# Altium project Distance-Sensor-Board.PrjPcb
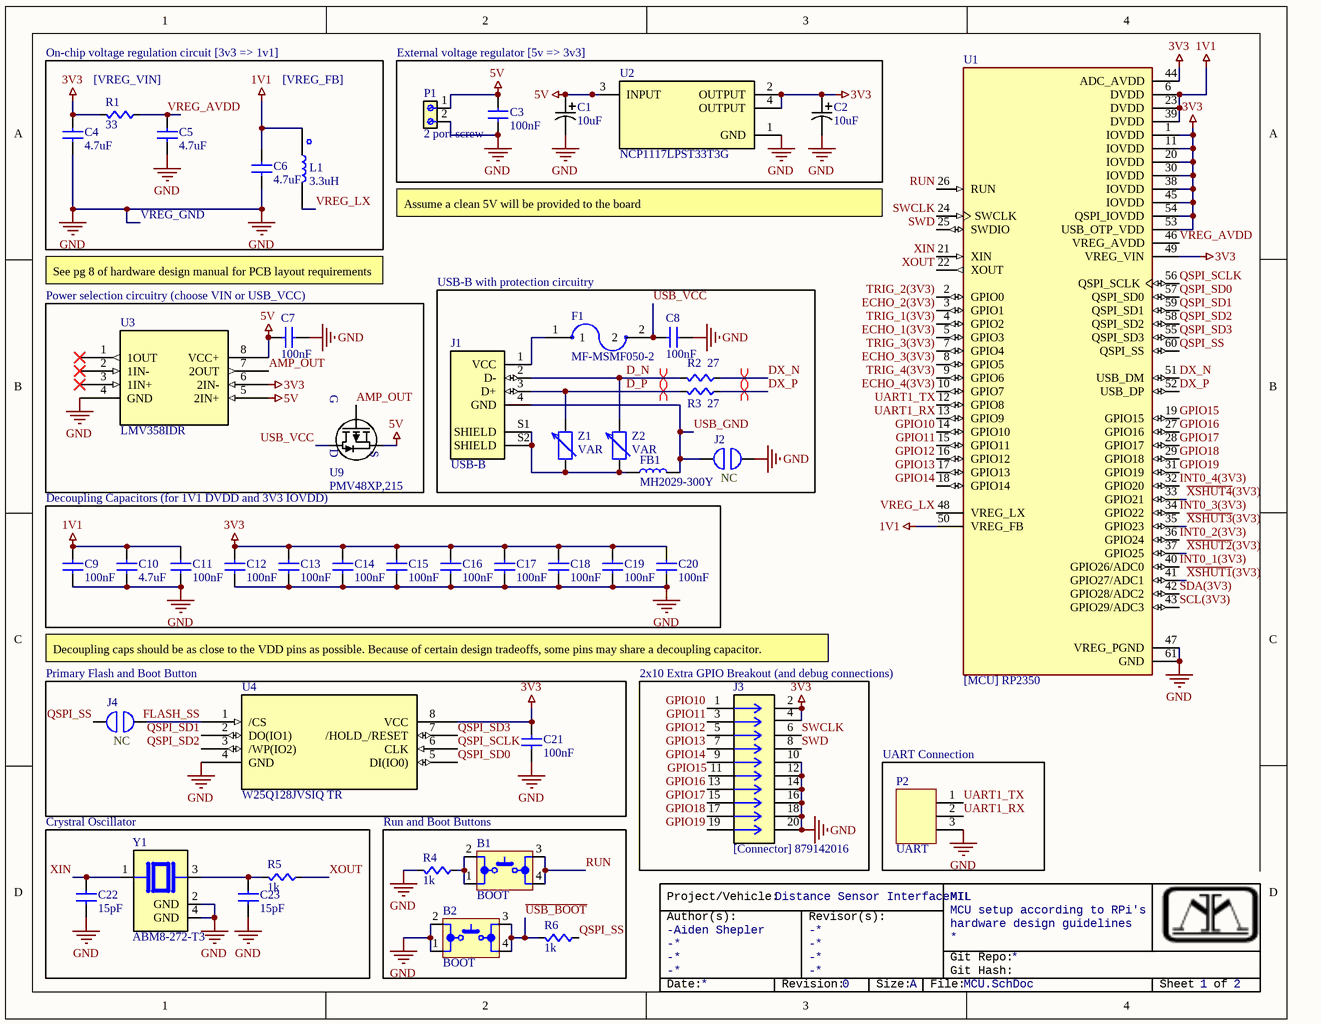
[diagram p0: MCU.SchDoc]
2 sheets, 85 parts. Net scope: global (net labels, ports and power ports of the same name join across sheets).
Board file: main.PcbDoc
Sheets:
  MCU.SchDoc
  Distance-Sensors.SchDoc

## Sheet MCU.SchDoc
size A; Organization: MIL; Address1: MCU setup according to RPi's; Address2: hardware design guidelines; Revision: 0; SheetNumber: 1; SheetTotal: 2; Project: Distance Sensor Interface; Author1: Aiden Shepler

### Parts
B1  BOOT  [SPST-PUSH-BUTTON]
B2  BOOT  [SPST-PUSH-BUTTON]
C1  10uF  [RADIAL_CAN_CAP_4_X_5.8_SMD]
C2  10uF  [RADIAL_CAN_CAP_4_X_5.8_SMD]
C3  value 100nF  [CAPC0603]  (hidden comment: Cap)
C4  value 4.7uF  [CAPC0603]  (hidden comment: Cap)
C5  value 4.7uF  [CAPC0603]  (hidden comment: Cap)
C6  value 4.7uF  [CAPC0603]  (hidden comment: Cap)
C7  value 100nF  [CAPC0603]  (hidden comment: Cap)
C8  value 100nF  [CAPC0603]  (hidden comment: Cap)
C9  value 100nF  [CAPC0603]  (hidden comment: Cap)
C10  value 4.7uF  [CAPC0603]  (hidden comment: Cap)
C11  value 100nF  [CAPC0603]  (hidden comment: Cap)
C12  value 100nF  [CAPC0603]  (hidden comment: Cap)
C13  value 100nF  [CAPC0603]  (hidden comment: Cap)
C14  value 100nF  [CAPC0603]  (hidden comment: Cap)
C15  value 100nF  [CAPC0603]  (hidden comment: Cap)
C16  value 100nF  [CAPC0603]  (hidden comment: Cap)
C17  value 100nF  [CAPC0603]  (hidden comment: Cap)
C18  value 100nF  [CAPC0603]  (hidden comment: Cap)
C19  value 100nF  [CAPC0603]  (hidden comment: Cap)
C20  value 100nF  [CAPC0603]  (hidden comment: Cap)
C21  value 100nF  [CAPC0603]  (hidden comment: Cap)
C22  value 15pF  [CAPC0603]  (hidden comment: Cap)
C23  value 15pF  [CAPC0603]  (hidden comment: Cap)
F1  MF-MSMF050-2  [FUSM4632X85]
FB1  MH2029-300Y  [L0805]
J1  USB-B  [SAMTEC_USB-B-S-X-X-TH]
J2  NO/NC: NC  [[Jumper] Solderable Jumper]  (hidden comment: Thru-Hole Jumper)
J3  [Connector] 879142016  [[Connector] CONN20]
J4  NO/NC: NC  [[Jumper] Solderable Jumper]  (hidden comment: Thru-Hole Jumper)
L1  3.3uH  [2016_SMD_Inductor]
P1  2 port screw  [[CONNECTOR] 5MM_2PORT_SCREW]
P2  UART  [MOLEX-HDR-1X3-SHERLOCK-RA]
R1  value 33  [RES0603]  (hidden comment: Res)
R2  value 27  [RES0603]  (hidden comment: Res)
R3  value 27  [RES0603]  (hidden comment: Res)
R4  value 1k  [RES0603]  (hidden comment: Res)
R5  value 1k  [RES0603]  (hidden comment: Res)
R6  value 1k  [RES0603]  (hidden comment: Res)
U1  [MCU] RP2350  [QFN40P700X700X90-61N]
U2  NCP1117LPST33T3G  [SOT230P700X175-4N]
U3  LMV358IDR  [SOIC-8]
U4  W25Q128JVSIQ TR  [SOIC_208MIL_WIN]
U9  PMV48XP,215  [SOT23_NEX]
Y1  ABM8-272-T3  [XTAL_ABM8-272-T3]
Z1  VAR  [VARC1608X56N]
Z2  VAR  [VARC1608X56N]

### Blocks framed on the sheet
External voltage regulator [5v => 3v3]: C1-C3 P1 U2
USB-B with protection circuitry: C8 F1 FB1 J1 J2 R2 R3 Z1 Z2
Power selection circuitry (choose VIN or USB_VCC): C7 U3 U9
Decoupling Capacitors (for 1V1 DVDD and 3V3 IOVDD): C9-C20
Primary Flash and Boot Button: C21 J4 U4
2x10 Extra GPIO Breakout (and debug connections): J3
UART Connection: P2
Crystral Oscillator: C22 C23 R5 Y1
Run and Boot Buttons: B1 B2 R4 R6

### Nets
1V1: C6.1(A) C9.1(A) C10.1(A) C11.1(A) L1.1 U1.6(DVDD) U1.23(DVDD) U1.39(DVDD) U1.50(VREG_FB)
3V3: C2.1 C4.1(A) C12.1(A) C13.1(A) C14.1(A) C15.1(A) C16.1(A) C17.1(A) C18.1(A) C19.1(A) C20.1(A) C21.1(A) J3.2 J3.4 R1.1(A) U1.1(IOVDD) U1.11(IOVDD) U1.20(IOVDD) U1.30(IOVDD) U1.38(IOVDD) U1.44(ADC_AVDD) U1.45(IOVDD) U1.49(VREG_VIN) U1.53(USB_OTP_VDD) U1.54(QSPI_IOVDD) U2.2(OUTPUT) U2.4(OUTPUT) U3.6(2IN-) U4.8(VCC)
5V: C1.1 C3.1(A) C7.1(A) P1.1 U2.3(INPUT) U3.5(2IN+) U3.8(VCC+) U9.2(S)
GND: B2.1 B2.2 C1.2 C2.2 C3.2(B) C4.2(B) C5.2(B) C6.2(B) C7.2(B) C8.1(A) C9.2(B) C10.2(B) C11.2(B) C12.2(B) C13.2(B) C14.2(B) C15.2(B) C16.2(B) C17.2(B) C18.2(B) C19.2(B) C20.2(B) C21.2(B) C22.2(B) C23.2(B) J2.2 J3.10 J3.12 J3.14 J3.16 J3.18 J3.20 P1.2 P2.3 R4.1(A) U1.47(VREG_PGND) U1.61(GND) U2.1(GND) U3.4(GND) U4.4(GND) Y1.2(GND) Y1.4(GND)
AMP_OUT: U3.7(2OUT) U9.1(G)
D_N: J1.2(D-) R2.1(A) Z2.2
D_P: J1.3(D+) R3.1(A) Z1.2
DX_N: R2.2(B) U1.51(USB_DM)
DX_P: R3.2(B) U1.52(USB_DP)
ECHO_1(3V3): U1.5(GPIO3)
ECHO_2(3V3): U1.3(GPIO1)
ECHO_3(3V3): U1.8(GPIO5)
ECHO_4(3V3): U1.10(GPIO7)
FLASH_SS: J4.2 U4.1(/CS)
GPIO10: J3.1 U1.14(GPIO10)
GPIO11: J3.3 U1.15(GPIO11)
GPIO12: J3.5 U1.16(GPIO12)
GPIO13: J3.7 U1.17(GPIO13)
GPIO14: J3.9 U1.18(GPIO14)
GPIO15: J3.11 U1.19(GPIO15)
GPIO16: J3.13 U1.27(GPIO16)
GPIO17: J3.15 U1.28(GPIO17)
GPIO18: J3.17 U1.29(GPIO18)
GPIO19: J3.19 U1.31(GPIO19)
INT0_1(3V3): U1.40(GPIO26/ADC0)
INT0_2(3V3): U1.36(GPIO24)
INT0_3(3V3): U1.34(GPIO22)
INT0_4(3V3): U1.32(GPIO20)
QSPI_SCLK: U1.56(QSPI_SCLK) U4.6(CLK)
QSPI_SD0: U1.57(QSPI_SD0) U4.5(DI(IO0))
QSPI_SD1: U1.59(QSPI_SD1) U4.2(DO(IO1))
QSPI_SD2: U1.58(QSPI_SD2) U4.3(/WP(IO2))
QSPI_SD3: U1.55(QSPI_SD3) U4.7(/HOLD_/RESET)
QSPI_SS: J4.1 R6.2(B) U1.60(QSPI_SS)
RUN: B1.3 B1.4 U1.26(RUN)
SCL(3V3): U1.43(GPIO29/ADC3)
SDA(3V3): U1.42(GPIO28/ADC2)
SWCLK: J3.6 U1.24(SWCLK)
SWD: J3.8 U1.25(SWDIO)
TRIG_1(3V3): U1.4(GPIO2)
TRIG_2(3V3): U1.2(GPIO0)
TRIG_3(3V3): U1.7(GPIO4)
TRIG_4(3V3): U1.9(GPIO6)
~{USB_BOOT}: B2.3 B2.4 R6.1(A)
UART1_RX: P2.2 U1.13(GPIO9)
UART1_TX: P2.1 U1.12(GPIO8)
USB_GND: FB1.2 J1.4(GND) J2.1
USB_VCC: C8.2(B) F1.2 U9.3(D)
VREG_AVDD: C5.1(A) R1.2(B) U1.46(VREG_AVDD)
VREG_LX: L1.2 U1.48(VREG_LX)
~{XSHUT1}(3V3): U1.41(GPIO27/ADC1)
~{XSHUT2}(3V3): U1.37(GPIO25)
~{XSHUT3}(3V3): U1.35(GPIO23)
~{XSHUT4}(3V3): U1.33(GPIO21)
XIN: C22.1(A) U1.21(XIN) Y1.1
XOUT: R5.2(B) U1.22(XOUT)
NetB1_1: B1.1 B1.2 R4.2(B)
NetC23_1: C23.1(A) R5.1(A) Y1.3
NetF1_1: F1.1 J1.1(VCC)
NetFB1_1: FB1.1 J1.S1(SHIELD) J1.S2(SHIELD) Z1.1 Z2.1

Not connected (* = marked no-connect by the designer): U3 1(1OUT)* 2(1IN-)* 3(1IN+)*

### Layout directives
differential pair: D_N, D_P, DX_N, DX_P

### Notes on the sheet
- On-chip voltage regulation circuit [3v3 => 1v1]
- [VREG_VIN]
- [VREG_FB]
- VREG_GND
- Assume a clean 5V will be provided to the board
- See pg 8 of hardware design manual for PCB layout requirements
- Decoupling caps should be as close to the VDD pins as possible. Because of certain design tradeoffs, some pins may share a decoupling capacitor.
- Project/Vehicle:
- Author(s):
- -
- Revisor(s):
- Git Repo:
- Git Hash:
- Date:
- Revision:
- Size:
- A
- File:
- Sheet
- of

### Library data of the parts
B1 B2 = 1825910-6: SWITCH TACTILE SPST-NO 0.05A 24V; Manufacturer: TE Connectivity Alcoswitch; Actuator Material: PBT; Mechanical Life: 100000Cycles; Operating Force: 160gf; Throw Configuration: SPST; Illumination Type: Non-Illuminated,Illuminated; Switch Travel: 0.25mm; Switch Function: Off-Mom; Contact Current Rating: 50mA; Actuator Type: Standard; Contact Resistance: 100mR; Actuator Length: 0.055inch; Manufacturer Part Number: 1825910-6; RoHS: Yes; Category: Pushbutton Switches; Stock 1: 97530; Pricing 1: 1=0,10000, 10=0,10100, 25=0,09560, 100=0,08700, 250=0,08180, 500=0,07484, 1000=0,06265, 2500=0,06092, 5000=0,05743 (USD); Mount: Through Hole; Contact Material: Copper Alloy; Contact Plating: Silver; Min Operating Temperature: -35°C; Max Operating Temperature: 85°C; Termination: PC Pins; Package Quantity: 750; Packaging: Loose Piece; Orientation: Straight; Max Voltage Rating (DC): 24V; Electrical Life: 100000Cycles; Max Current Rating: 50mA; Type: Switch; Length: 5.99mm; REACH SVHC: Unknown; ELV: Compliant; Lead Free: Lead Free; ComponentLink1URL: https://datasheet.ciiva.com/30199/1825910-6rqpn1825910-6-30199520.pdf?src-supplier=Onlinecomponents.com; ComponentLink1Description: https://datasheet.ciiva.com/30199/1825910-6rqpn1825910-6-30199520.pdf?src-supplier=Onlinecomponents.com; ComponentLink2URL: https://datasheet.ciiva.com/15184/getdatasheetpartid-395915-15184509.pdf?src-supplier=Verical; ComponentLink2Description: https://datasheet.ciiva.com/15184/getdatasheetpartid-395915-15184509.pdf?src-supplier=Verical; Supplier 1: Digi-Key; Supplier Part Number 1: 450-1650-ND
C1 C2 = EEE-FK1E100R: 10uF electrolytic cap, radial can, SMD; Manufacturer_Name: Panasonic; Copyright: Copyright (C) 2025 Ultra Librarian. All rights reserved.; Manufacturer_Part_Number: EEE-FK1E100R
F1 = MF-MSMF050-2: [Fuse] Polymeric PTC Resettable Fuse 15V 500 mA Ih Surface Mount 1812 (4532 Metric), Concave; MF: Bourns; MP: MF-MSMF050-2; Availability: In Stock; Check_prices: https://www.snapeda.com/parts/MF-MSMF050-2/Bourns+-+J.W.+Miller/view-part/?ref=eda; Price: None; Package: 1812 Bourns; Purchase-URL: https://pricing.snapeda.com/search/part/MF-MSMF050-2/?ref=eda; Value: *; SnapEDA_Link: https://www.snapeda.com/parts/MF-MSMF050-2/Bourns+-+J.W.+Miller/view-part/?ref=snap
FB1 = MH2029-300Y: [Inductor] Ferrite Bead Bourns MH2029-300Y / SMD-FERRITE-BEAD-30R-3A(0805); SnapEDA_Link: https://www.snapeda.com/parts/MH2029-300Y/Bourns/view-part/?ref=snap; Package: 0805 Bourns; Value: *; MF: Bourns; MP: MH2029-300Y; Check_prices: https://www.snapeda.com/parts/MH2029-300Y/Bourns/view-part/?ref=eda
J1 = USB-B-S-X-X-TH: USB-B (USB TYPE-B) USB 2.0 Receptacle Connector 4 Position Through Hole, Right Angle; MF: Samtec; MP: USB-B-S-F-W-TH-TR; SnapEDA_Link: https://www.snapeda.com/parts/USB-B-S-F-W-TH-TR/Samtec/view-part/?ref=snap; Package: None; Value: *; Check_prices: https://www.snapeda.com/parts/USB-B-S-F-W-TH-TR/Samtec/view-part/?ref=eda
J2 J4 = [Jump] Thru-Hole 2pin: Clip Jumper
J3 = [Connector] 879142016: 2x10 2.54mm pitch header; Package: None; Price: None; Value: *; MP: 879142016; Availability: Unavailable
L1 = INDUCTOR 3.3uH: Power Inductors - SMD IND 3.3uH used for RP2350 VREG; Manufacturer_Name: ABRACON; Manufacturer_Part_Number: AOTA-B201610S3R3-101-T; Geometry.Height: 1mm; Mouser Part Number: 815-AB201610S3R3101T; Mouser Price/Stock: https://www.mouser.co.uk/ProductDetail/ABRACON/AOTA-B201610S3R3-101-T?qs=%252BXxaIXUDbq0IZvJW%2F2mv4w%3D%3D; Datasheet Link: https://abracon.com/datasheets/AOTA-B201610S3R3-101-T.pdf
P1 = [Connector] 691213510002: 2 Position Wire to Board Terminal Block Horizontal with Board 0.200 (5.08mm) Through Hole; MF: WÃ¼rth Elektronik; SnapEDA_Link: https://www.snapeda.com/parts/691213510002/W%25C3%25BCrth+Elektronik+Midcom/view-part/?ref=snap; Package: None; Value: *; MP: 691213510002; Check_prices: https://www.snapeda.com/parts/691213510002/W%25C3%25BCrth+Elektronik+Midcom/view-part/?ref=eda
P2 = MOLEX-HDR-1x3-SHERLOCK_RA: Header, Molex, 2mm Pitch Sherlock Header, Single Row, Right Angle 3 Circuits, Length 3.3mm; Manufacturer Part Number: 35363-0360; Manufacturer: Molex Connector Corporation; Supplier Part Number 1: WM18932-ND; Supplier 1: Digi-Key
R1-R6 = Res: SMD, RES0603; Supplier 1: Digi-Key; Supplier Part Number 1: RMCF0603JT10K0CT-ND
U1 = SC1509(13): RP2350A MCU from Raspberry Pi Pico; QFN 60 7x7,; MP: SC1509-A4; SnapEDA_Link: https://www.snapeda.com/parts/SC1509-A4/Raspberry+Pi/view-part/?ref=snap; Package: None; Value: *; MF: Raspberry Pi; Check_prices: https://www.snapeda.com/parts/SC1509-A4/Raspberry+Pi/view-part/?ref=eda
U2 = NCP1117LPST33T3G: Linear Voltage Regulator IC Positive Fixed 1 Output 1A SOT-223; MF: ON Semiconductor; SnapEDA_Link: https://www.snapeda.com/parts/NCP1117LPST33T3G/Onsemi/view-part/?ref=snap; Package: SOT-223-4 ON Semiconductor; Value: *; MP: NCP1117LPST33T3G; Check_prices: https://www.snapeda.com/parts/NCP1117LPST33T3G/Onsemi/view-part/?ref=eda
U3 = LMV358IDR: [Op-Amp] Dual, 5.5-V, 1-MHz, RRO operational amplifier 8-SOIC -40 to 125; Manufacturer_Name: Texas Instruments; Copyright: Copyright (C) 2025 Ultra Librarian. All rights reserved.; Manufacturer_Part_Number: LMV358IDR; Datasheet: https://www.ti.com/lit/gpn/lmv358; RefDes: RefDes; Type: Type
U4 = W25Q128JVSIQ TR: IC FLASH 128MBIT SPI/QUAD 8SOIC; Manufacturer_Name: Winbond; Copyright: Copyright (C) 2025 Ultra Librarian. All rights reserved.; Manufacturer_Part_Number: W25Q128JVSIQ TR; RefDes: RefDes; Type: Type
U9 = [PMOS] PMV48XP,215: MOSFET P-CH 20V 3.5A TO236AB; Manufacturer_Name: Nexperia; Copyright: Copyright (C) 2025 Ultra Librarian. All rights reserved.; Manufacturer_Part_Number: PMV48XP,215
Y1 = ABM8-272-T3: 12 MHz Â±30ppm Crystal 10pF 50 Ohms 4-SMD, No Lead; MF: ABRACON; SnapEDA_Link: https://www.snapeda.com/parts/ABM8-272-T3/Abracon/view-part/?ref=snap; Package: NON-STANDARD-4 Abracon; Value: *; MP: ABM8-272-T3; Check_prices: https://www.snapeda.com/parts/ABM8-272-T3/Abracon/view-part/?ref=eda
Z1 Z2 = CG0603MLC-05E: [Varistor] 1 Circuit Surface Mount, MLCV 0603 (1608 Metric); MF: Bourns; Package: 0603 Bourns Inc.; Availability: In Stock; Value: *; MP: CG0603MLC-05E; Purchase-URL: https://pricing.snapeda.com/search/part/CG0603MLC-05E/?ref=eda; Check_prices: https://www.snapeda.com/parts/CG0603MLC-05E/Bourns+-+J.W.+Miller/view-part/?ref=eda; Price: None; SnapEDA_Link: https://www.snapeda.com/parts/CG0603MLC-05E/Bourns+-+J.W.+Miller/view-part/?ref=snap
C3-C23 = Cap: Supplier 1: Digi-Key; Supplier Part Number 1: 1276-1000-1-ND

## Sheet Distance-Sensors.SchDoc: Distance Sensor Interface
size A; Organization: MIL; Address1: Level-shifting circuitry for ToF; Address2: and headers for both ToF and; Address3: ultrasonic sensors; Revision: 0; SheetNumber: 2; SheetTotal: 2; Project: Distance Sensor Interface; Author1: Aiden Shepler
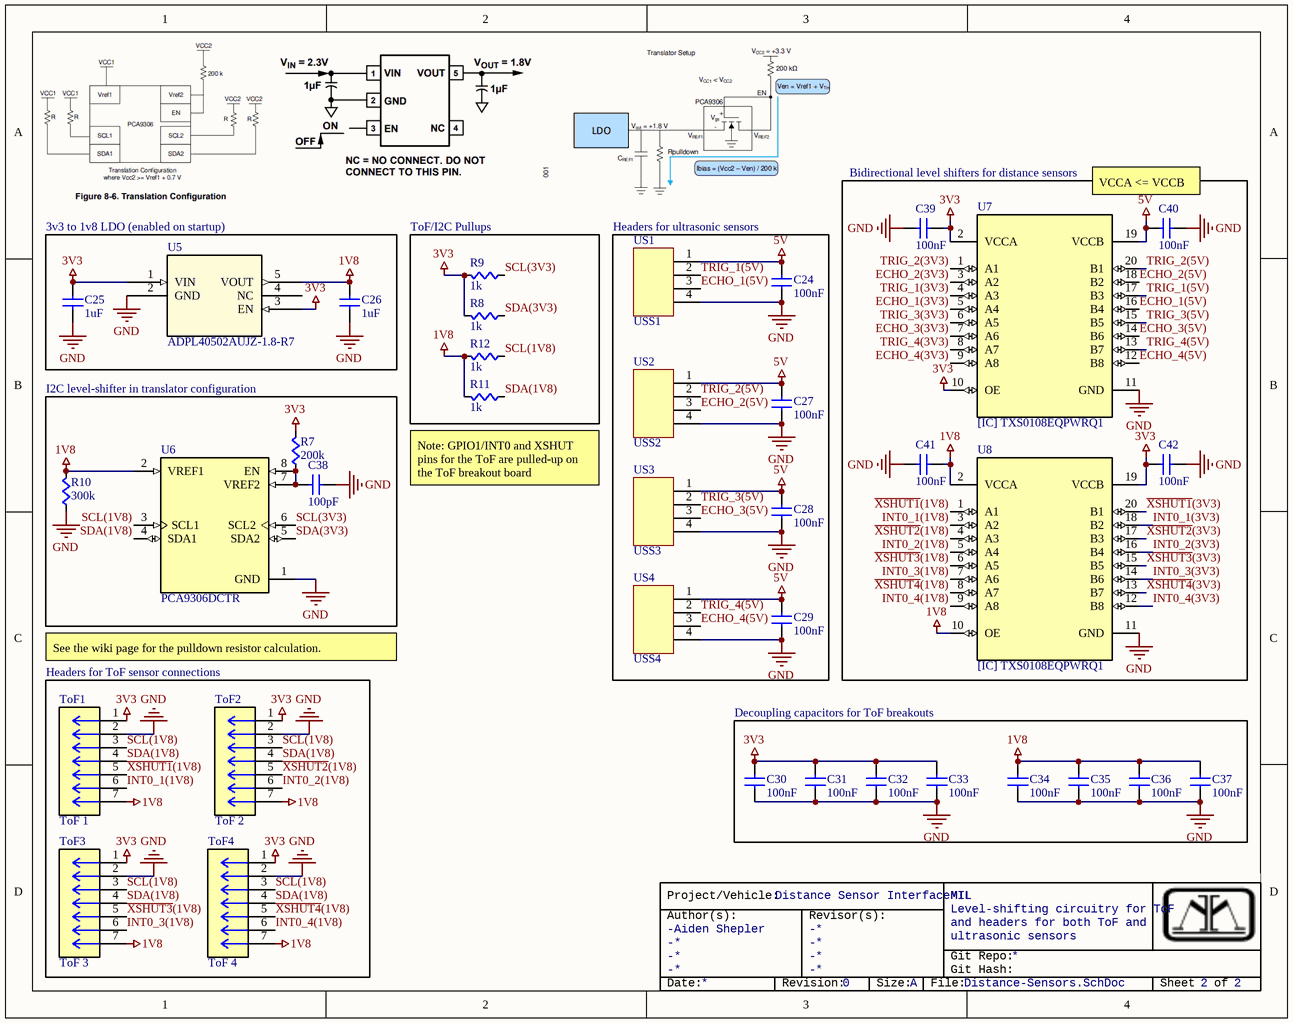
[diagram p1: Distance-Sensors.SchDoc]

### Parts
C24  value 100nF  [CAPC0603]  (hidden comment: Cap)
C25  value 1uF  [CAPC0603]  (hidden comment: Cap)
C26  value 1uF  [CAPC0603]  (hidden comment: Cap)
C27  value 100nF  [CAPC0603]  (hidden comment: Cap)
C28  value 100nF  [CAPC0603]  (hidden comment: Cap)
C29  value 100nF  [CAPC0603]  (hidden comment: Cap)
C30  value 100nF  [CAPC0603]  (hidden comment: Cap)
C31  value 100nF  [CAPC0603]  (hidden comment: Cap)
C32  value 100nF  [CAPC0603]  (hidden comment: Cap)
C33  value 100nF  [CAPC0603]  (hidden comment: Cap)
C34  value 100nF  [CAPC0603]  (hidden comment: Cap)
C35  value 100nF  [CAPC0603]  (hidden comment: Cap)
C36  value 100nF  [CAPC0603]  (hidden comment: Cap)
C37  value 100nF  [CAPC0603]  (hidden comment: Cap)
C38  value 100pF  [CAPC0603]  (hidden comment: Cap)
C39  value 100nF  [CAPC0603]  (hidden comment: Cap)
C40  value 100nF  [CAPC0603]  (hidden comment: Cap)
C41  value 100nF  [CAPC0603]  (hidden comment: Cap)
C42  value 100nF  [CAPC0603]  (hidden comment: Cap)
R7  value 200k  [RES0603]  (hidden comment: Res)
R8  value 1k  [RES0603]  (hidden comment: Res)
R9  value 1k  [RES0603]  (hidden comment: Res)
R10  value 300k  [RES0603]  (hidden comment: Res)
R11  value 1k  [RES0603]  (hidden comment: Res)
R12  value 1k  [RES0603]  (hidden comment: Res)
ToF1  ToF 1  [7POS_2MM_CONN]
ToF2  ToF 2  [7POS_2MM_CONN]
ToF3  ToF 3  [7POS_2MM_CONN]
ToF4  ToF 4  [7POS_2MM_CONN]
U5  ADPL40502AUJZ-1.8-R7  [TSOT-23-5_UJ-5_ADI]
U6  PCA9306DCTR  [SOP65P400X130-8N]
U7  [IC] TXS0108EQPWRQ1  [SOP65P640X120-20N]
U8  [IC] TXS0108EQPWRQ1  [SOP65P640X120-20N]
US1  USS1  [MOLEX-HDR-1X4-SHERLOCK-VERT]
US2  USS2  [MOLEX-HDR-1X4-SHERLOCK-VERT]
US3  USS3  [MOLEX-HDR-1X4-SHERLOCK-VERT]
US4  USS4  [MOLEX-HDR-1X4-SHERLOCK-VERT]

### Blocks framed on the sheet
Bidirectional level shifters for distance sensors: C39-C42 U7 U8
3v3 to 1v8 LDO (enabled on startup): C25 C26 U5
ToF/I2C Pullups: R8 R9 R11 R12
Headers for ultrasonic sensors: C24 C27-C29 US1-US4
I2C level-shifter in translator configuration: C38 R7 R10 U6
Headers for ToF sensor connections: ToF1-ToF4
Decoupling capacitors for ToF breakouts: C30-C37

### Nets
1V8: C26.1(A) C34.1(A) C35.1(A) C36.1(A) C37.1(A) C41.2(B) R10.1(A) R11.1(A) R12.1(A) ToF1.7 ToF2.7 ToF3.7 ToF4.7 U5.5(VOUT) U6.2(VREF1) U8.2(VCCA) U8.10(OE)
3V3: C25.1(A) C30.1(A) C31.1(A) C32.1(A) C33.1(A) C39.2(B) C42.2(B) R7.1(A) R8.1(A) R9.1(A) ToF1.1 ToF2.1 ToF3.1 ToF4.1 U5.1(VIN) U5.3(EN) U7.2(VCCA) U7.10(OE) U8.19(VCCB)
5V: C24.1(A) C27.1(A) C28.1(A) C29.1(A) C40.1(A) U7.19(VCCB) US1.1 US2.1 US3.1 US4.1
GND: C24.2(B) C25.2(B) C26.2(B) C27.2(B) C28.2(B) C29.2(B) C30.2(B) C31.2(B) C32.2(B) C33.2(B) C34.2(B) C35.2(B) C36.2(B) C37.2(B) C38.2(B) C39.1(A) C40.2(B) C41.1(A) C42.1(A) R10.2(B) ToF1.2 ToF2.2 ToF3.2 ToF4.2 U5.2(GND) U6.1(GND) U7.11(GND) U8.11(GND) US1.4 US2.4 US3.4 US4.4
ECHO_1(3V3): U7.5(A4)
ECHO_1(5V): U7.16(B4) US1.3
ECHO_2(3V3): U7.3(A2)
ECHO_2(5V): U7.18(B2) US2.3
ECHO_3(3V3): U7.7(A6)
ECHO_3(5V): U7.14(B6) US3.3
ECHO_4(3V3): U7.9(A8)
ECHO_4(5V): U7.12(B8) US4.3
INT0_1(1V8): ToF1.6 U8.3(A2)
INT0_1(3V3): U8.18(B2)
INT0_2(1V8): ToF2.6 U8.5(A4)
INT0_2(3V3): U8.16(B4)
INT0_3(1V8): ToF3.6 U8.7(A6)
INT0_3(3V3): U8.14(B6)
INT0_4(1V8): ToF4.6 U8.9(A8)
INT0_4(3V3): U8.12(B8)
SCL(1V8): R12.2(B) ToF1.3 ToF2.3 ToF3.3 ToF4.3 U6.3(SCL1)
SCL(3V3): R9.2(B) U6.6(SCL2)
SDA(1V8): R11.2(B) ToF1.4 ToF2.4 ToF3.4 ToF4.4 U6.4(SDA1)
SDA(3V3): R8.2(B) U6.5(SDA2)
TRIG_1(3V3): U7.4(A3)
TRIG_1(5V): U7.17(B3) US1.2
TRIG_2(3V3): U7.1(A1)
TRIG_2(5V): U7.20(B1) US2.2
TRIG_3(3V3): U7.6(A5)
TRIG_3(5V): U7.15(B5) US3.2
TRIG_4(3V3): U7.8(A7)
TRIG_4(5V): U7.13(B7) US4.2
~{XSHUT1}(1V8): ToF1.5 U8.1(A1)
~{XSHUT1}(3V3): U8.20(B1)
~{XSHUT2}(1V8): ToF2.5 U8.4(A3)
~{XSHUT2}(3V3): U8.17(B3)
~{XSHUT3}(1V8): ToF3.5 U8.6(A5)
~{XSHUT3}(3V3): U8.15(B5)
~{XSHUT4}(1V8): ToF4.5 U8.8(A7)
~{XSHUT4}(3V3): U8.13(B7)
NetC38_1: C38.1(A) R7.2(B) U6.7(VREF2) U6.8(EN)

Not connected (* = marked no-connect by the designer): U5 4(NC)

### Notes on the sheet
- VCCA <= VCCB
- (near R11) Note: GPIO1/INT0 and XSHUT pins for the ToF are pulled-up on the ToF breakout board
- See the wiki page for the pulldown resistor calculation.
- Project/Vehicle:
- Author(s):
- -
- Revisor(s):
- Git Repo:
- Git Hash:
- Date:
- Revision:
- Size:
- A
- File:
- Sheet
- of

### Library data of the parts
R7-R12 = Res: SMD, RES0603; Supplier 1: Digi-Key; Supplier Part Number 1: RMCF0603JT10K0CT-ND
ToF1-ToF4 = MOLEX_SHERLOCK_1x7_CONN: 1x7 2mm pitch sherlock connector; MP: 353620750; Package: None; Price: None; Value: *; Availability: Unavailable
U5 = ADPL40502AUJZ-1.8-R7: Low Noise, 200mA, CMOS Linear Regulator (LDO); Manufacturer_Name: Analog Devices Inc; Copyright: Copyright (C) 2025 Ultra Librarian. All rights reserved.; Manufacturer_Part_Number: ADPL40502AUJZ-1.8-R7; RefDes: RefDes; Type: Type
U6 = PCA9306DCTR: 2-bit bidirectional 400-kHz I2C/SMBus voltage level translator; MF: Texas Instruments; SnapEDA_Link: https://www.snapeda.com/parts/PCA9306DCTR/Texas+Instruments/view-part/?ref=snap; Package: SSOP-8 Texas Instruments; Value: *; MP: PCA9306DCTR; Check_prices: https://www.snapeda.com/parts/PCA9306DCTR/Texas+Instruments/view-part/?ref=eda
U7 U8 = [IC] TXS0108EQPWRQ1: Automotive eight-bit bidirectional voltage level shifter for open-drain and push-pull applications; MF: Texas Instruments; SnapEDA_Link: https://www.snapeda.com/parts/TXS0108EQPWRQ1/Texas+Instruments/view-part/?ref=snap; Package: TSSOP-20 Texas Instruments; Value: *; MP: TXS0108EQPWRQ1; Check_prices: https://www.snapeda.com/parts/TXS0108EQPWRQ1/Texas+Instruments/view-part/?ref=eda; ComponentLink1Description: DigiKey_Link; ComponentLink1URL: https://www.digikey.com/en/products/detail/texas-instruments/TXS0108EQPWRQ1/5324256?s=N4IgTCBcDaICoA0DKAGAjCgHAUQIoAUB1AJVzRAF0BfIA
US1-US4 = MOLEX-HDR-1x4-SHERLOCK_VERT: Header, Molex, 2mm Pitch Sherlock Header, Single Row, Vertical, 4 Circuits, Length 3.3mm, 0353620450; Manufacturer Part Number: *; Order Part Number: *
C24-C42 = Cap: Supplier 1: Digi-Key; Supplier Part Number 1: 1276-1000-1-ND

## Nets that join several sheets
3V3: MCU (29 pins), Distance-Sensors (19 pins)
5V: MCU (8 pins), Distance-Sensors (10 pins)
GND: MCU (42 pins), Distance-Sensors (32 pins)
ECHO_1(3V3): MCU (U1.5), Distance-Sensors (U7.5)
ECHO_2(3V3): MCU (U1.3), Distance-Sensors (U7.3)
ECHO_3(3V3): MCU (U1.8), Distance-Sensors (U7.7)
ECHO_4(3V3): MCU (U1.10), Distance-Sensors (U7.9)
INT0_1(3V3): MCU (U1.40), Distance-Sensors (U8.18)
INT0_2(3V3): MCU (U1.36), Distance-Sensors (U8.16)
INT0_3(3V3): MCU (U1.34), Distance-Sensors (U8.14)
INT0_4(3V3): MCU (U1.32), Distance-Sensors (U8.12)
SCL(3V3): MCU (U1.43), Distance-Sensors (R9.2 U6.6)
SDA(3V3): MCU (U1.42), Distance-Sensors (R8.2 U6.5)
TRIG_1(3V3): MCU (U1.4), Distance-Sensors (U7.4)
TRIG_2(3V3): MCU (U1.2), Distance-Sensors (U7.1)
TRIG_3(3V3): MCU (U1.7), Distance-Sensors (U7.6)
TRIG_4(3V3): MCU (U1.9), Distance-Sensors (U7.8)
~{XSHUT1}(3V3): MCU (U1.41), Distance-Sensors (U8.20)
~{XSHUT2}(3V3): MCU (U1.37), Distance-Sensors (U8.17)
~{XSHUT3}(3V3): MCU (U1.35), Distance-Sensors (U8.15)
~{XSHUT4}(3V3): MCU (U1.33), Distance-Sensors (U8.13)